# EAGLE schematic Jonah-ar PANEL - LCD-midi (EAGLE 6.4)

## Sheet 1 of 4
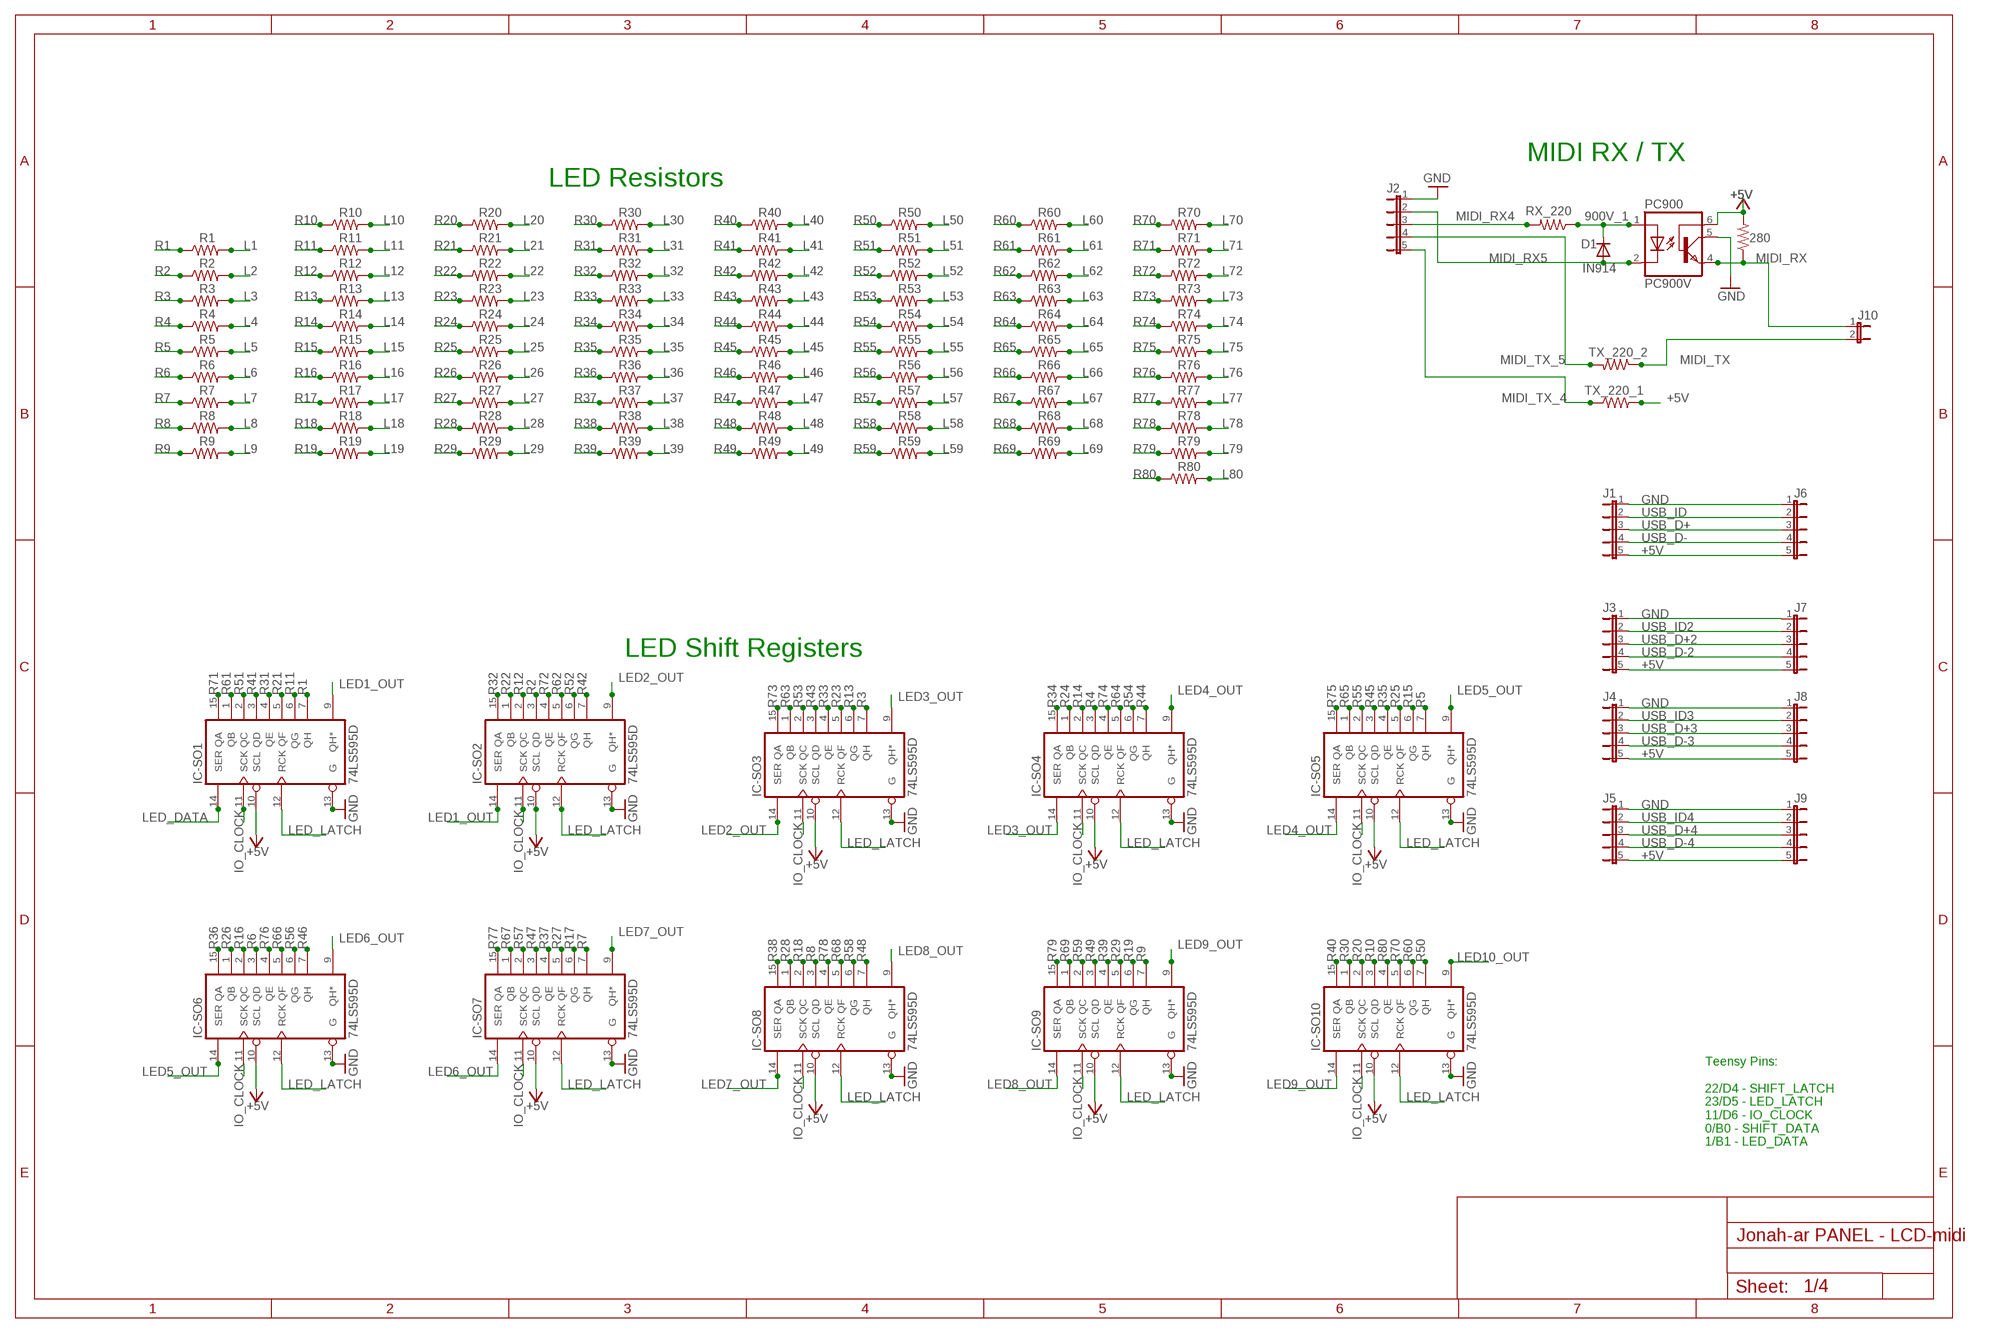
[diagram p0: schematic, sheet 1]

### Parts
280  280  R-US_0204/5  [0204/5]
D1  IN914  DIODE-DO34-7  [DO34-7]
IC-SO1  74LS595D  [SO16]
IC-SO2  74LS595D  [SO16]
IC-SO3  74LS595D  [SO16]
IC-SO4  74LS595D  [SO16]
IC-SO5  74LS595D  [SO16]
IC-SO6  74LS595D  [SO16]
IC-SO7  74LS595D  [SO16]
IC-SO8  74LS595D  [SO16]
IC-SO9  74LS595D  [SO16]
IC-SO10  74LS595D  [SO16]
J1  JP5E  [JP5]
J2  JP5E  [JP5]
J3  JP5E  [JP5]
J4  JP5E  [JP5]
J5  JP5E  [JP5]
J6  JP5E  [JP5]
J7  JP5E  [JP5]
J8  JP5E  [JP5]
J9  JP5E  [JP5]
J10  JP1E  [JP1]
PC900  PC900V  4N35SM  [DIL6-SMD]
R1  R-US_0204/5  [0204/5]
R2  R-US_0204/5  [0204/5]
R3  R-US_0204/5  [0204/5]
R4  R-US_0204/5  [0204/5]
R5  R-US_0204/5  [0204/5]
R6  R-US_0204/5  [0204/5]
R7  R-US_0204/5  [0204/5]
R8  R-US_0204/5  [0204/5]
R9  R-US_0204/5  [0204/5]
R10  R-US_0204/5  [0204/5]
R11  R-US_0204/5  [0204/5]
R12  R-US_0204/5  [0204/5]
R13  R-US_0204/5  [0204/5]
R14  R-US_0204/5  [0204/5]
R15  R-US_0204/5  [0204/5]
R16  R-US_0204/5  [0204/5]
R17  R-US_0204/5  [0204/5]
R18  R-US_0204/5  [0204/5]
R19  R-US_0204/5  [0204/5]
R20  R-US_0204/5  [0204/5]
R21  R-US_0204/5  [0204/5]
R22  R-US_0204/5  [0204/5]
R23  R-US_0204/5  [0204/5]
R24  R-US_0204/5  [0204/5]
R25  R-US_0204/5  [0204/5]
R26  R-US_0204/5  [0204/5]
R27  R-US_0204/5  [0204/5]
R28  R-US_0204/5  [0204/5]
R29  R-US_0204/5  [0204/5]
R30  R-US_0204/5  [0204/5]
R31  R-US_0204/5  [0204/5]
R32  R-US_0204/5  [0204/5]
R33  R-US_0204/5  [0204/5]
R34  R-US_0204/5  [0204/5]
R35  R-US_0204/5  [0204/5]
R36  R-US_0204/5  [0204/5]
R37  R-US_0204/5  [0204/5]
R38  R-US_0204/5  [0204/5]
R39  R-US_0204/5  [0204/5]
R40  R-US_0204/5  [0204/5]
R41  R-US_0204/5  [0204/5]
R42  R-US_0204/5  [0204/5]
R43  R-US_0204/5  [0204/5]
R44  R-US_0204/5  [0204/5]
R45  R-US_0204/5  [0204/5]
R46  R-US_0204/5  [0204/5]
R47  R-US_0204/5  [0204/5]
R48  R-US_0204/5  [0204/5]
R49  R-US_0204/5  [0204/5]
R50  R-US_0204/5  [0204/5]
R51  R-US_0204/5  [0204/5]
R52  R-US_0204/5  [0204/5]
R53  R-US_0204/5  [0204/5]
R54  R-US_0204/5  [0204/5]
R55  R-US_0204/5  [0204/5]
R56  R-US_0204/5  [0204/5]
R57  R-US_0204/5  [0204/5]
R58  R-US_0204/5  [0204/5]
R59  R-US_0204/5  [0204/5]
R60  R-US_0204/5  [0204/5]
R61  R-US_0204/5  [0204/5]
R62  R-US_0204/5  [0204/5]
R63  R-US_0204/5  [0204/5]
R64  R-US_0204/5  [0204/5]
R65  R-US_0204/5  [0204/5]
R66  R-US_0204/5  [0204/5]
R67  R-US_0204/5  [0204/5]
R68  R-US_0204/5  [0204/5]
R69  R-US_0204/5  [0204/5]
R70  R-US_0204/5  [0204/5]
R71  R-US_0204/5  [0204/5]
R72  R-US_0204/5  [0204/5]
R73  R-US_0204/5  [0204/5]
R74  R-US_0204/5  [0204/5]
R75  R-US_0204/5  [0204/5]
R76  R-US_0204/5  [0204/5]
R77  R-US_0204/5  [0204/5]
R78  R-US_0204/5  [0204/5]
R79  R-US_0204/5  [0204/5]
R80  R-US_0204/5  [0204/5]
RX_220  220  R-US_0204/5  [0204/5]
TX_220_1  220  R-US_0204/5  [0204/5]
TX_220_2  220  R-US_0204/5  [0204/5]

### Nets
900V_1: D1.C PC900.1(A) RX_220.1
+5V: 280.2 IC-SO1.10(SCL) IC-SO2.10(SCL) IC-SO3.10(SCL) IC-SO4.10(SCL) IC-SO5.10(SCL) IC-SO6.10(SCL) IC-SO7.10(SCL) IC-SO8.10(SCL) IC-SO9.10(SCL) IC-SO10.10(SCL) J1.5 J3.5 J4.5 J5.5 J6.5 J7.5 J8.5 J9.5 PC900.6(BAS) TX_220_1.2 ; also sheet 2
GND: IC-SO1.13(G) IC-SO2.13(G) IC-SO3.13(G) IC-SO4.13(G) IC-SO5.13(G) IC-SO6.13(G) IC-SO7.13(G) IC-SO8.13(G) IC-SO9.13(G) IC-SO10.13(G) J1.1 J2.1 J3.1 J4.1 J5.1 J6.1 J7.1 J8.1 J9.1 PC900.5(COL) ; also sheet 2,3,4
IO_CLOCK: IC-SO1.11(SCK) IC-SO2.11(SCK) IC-SO3.11(SCK) IC-SO4.11(SCK) IC-SO5.11(SCK) IC-SO6.11(SCK) IC-SO7.11(SCK) IC-SO8.11(SCK) IC-SO9.11(SCK) IC-SO10.11(SCK) ; also sheet 2
L1: R1.2 ; also sheet 3
L2: R2.2 ; also sheet 3
L3: R3.2 ; also sheet 3
L4: R4.2 ; also sheet 3
L5: R5.2 ; also sheet 3
L6: R6.2 ; also sheet 3
L7: R7.2 ; also sheet 3
L8: R8.2 ; also sheet 3
L9: R9.2 ; also sheet 3
L10: R10.2 ; also sheet 3
L11: R11.2 ; also sheet 3
L12: R12.2 ; also sheet 3
L13: R13.2 ; also sheet 3
L14: R14.2 ; also sheet 3
L15: R15.2 ; also sheet 3
L16: R16.2 ; also sheet 3
L17: R17.2 ; also sheet 3
L18: R18.2 ; also sheet 3
L19: R19.2 ; also sheet 3
L20: R20.2 ; also sheet 3
L21: R21.2 ; also sheet 3
L22: R22.2 ; also sheet 3
L23: R23.2 ; also sheet 3
L24: R24.2 ; also sheet 3
L25: R25.2 ; also sheet 3
L26: R26.2 ; also sheet 3
L27: R27.2 ; also sheet 3
L28: R28.2 ; also sheet 3
L29: R29.2 ; also sheet 3
L30: R30.2 ; also sheet 3
L31: R31.2 ; also sheet 3
L32: R32.2 ; also sheet 3
L33: R33.2 ; also sheet 3
L34: R34.2 ; also sheet 3
L35: R35.2 ; also sheet 3
L36: R36.2 ; also sheet 3
L37: R37.2 ; also sheet 3
L38: R38.2 ; also sheet 3
L39: R39.2 ; also sheet 3
L40: R40.2 ; also sheet 3
L41: R41.2 ; also sheet 4
L42: R42.2 ; also sheet 4
L43: R43.2 ; also sheet 4
L44: R44.2 ; also sheet 4
L45: R45.2 ; also sheet 4
L46: R46.2 ; also sheet 4
L47: R47.2 ; also sheet 4
L48: R48.2 ; also sheet 4
L49: R49.2 ; also sheet 4
L50: R50.2 ; also sheet 4
L51: R51.2 ; also sheet 4
L52: R52.2 ; also sheet 4
L53: R53.2 ; also sheet 4
L54: R54.2 ; also sheet 4
L55: R55.2 ; also sheet 4
L56: R56.2 ; also sheet 4
L57: R57.2 ; also sheet 4
L58: R58.2 ; also sheet 4
L59: R59.2 ; also sheet 4
L60: R60.2 ; also sheet 4
L61: R61.2 ; also sheet 4
L62: R62.2 ; also sheet 4
L63: R63.2 ; also sheet 4
L64: R64.2 ; also sheet 4
L65: R65.2 ; also sheet 4
L66: R66.2 ; also sheet 4
L67: R67.2 ; also sheet 4
L68: R68.2 ; also sheet 4
L69: R69.2 ; also sheet 4
L70: R70.2 ; also sheet 4
L71: R71.2 ; also sheet 4
L72: R72.2 ; also sheet 4
L73: R73.2 ; also sheet 4
L74: R74.2 ; also sheet 4
L75: R75.2 ; also sheet 4
L76: R76.2 ; also sheet 4
L77: R77.2 ; also sheet 4
L78: R78.2 ; also sheet 4
L79: R79.2 ; also sheet 4
L80: R80.2 ; also sheet 4
LED1_OUT: IC-SO1.9(QH*) IC-SO2.14(SER)
LED2_OUT: IC-SO2.9(QH*) IC-SO3.14(SER)
LED3_OUT: IC-SO3.9(QH*) IC-SO4.14(SER)
LED4_OUT: IC-SO4.9(QH*) IC-SO5.14(SER)
LED5_OUT: IC-SO5.9(QH*) IC-SO6.14(SER)
LED6_OUT: IC-SO6.9(QH*) IC-SO7.14(SER)
LED7_OUT: IC-SO7.9(QH*) IC-SO8.14(SER)
LED8_OUT: IC-SO8.9(QH*) IC-SO9.14(SER)
LED9_OUT: IC-SO9.9(QH*) IC-SO10.14(SER)
LED10_OUT: IC-SO10.9(QH*)
LED_DATA: IC-SO1.14(SER)
LED_LATCH: IC-SO1.12(RCK) IC-SO2.12(RCK) IC-SO3.12(RCK) IC-SO4.12(RCK) IC-SO5.12(RCK) IC-SO6.12(RCK) IC-SO7.12(RCK) IC-SO8.12(RCK) IC-SO9.12(RCK) IC-SO10.12(RCK)
MIDI_RX: 280.1 J10.1 PC900.4(EMI)
MIDI_RX4: J2.3 RX_220.2
MIDI_RX5: D1.A J2.2 PC900.2(C)
MIDI_TX: J10.2 TX_220_2.1
MIDI_TX_4: J2.5 TX_220_1.1
MIDI_TX_5: J2.4 TX_220_2.2
R1: IC-SO1.7(QH) R1.1
R2: IC-SO2.3(QD) R2.1
R3: IC-SO3.7(QH) R3.1
R4: IC-SO4.3(QD) R4.1
R5: IC-SO5.7(QH) R5.1
R6: IC-SO6.3(QD) R6.1
R7: IC-SO7.7(QH) R7.1
R8: IC-SO8.3(QD) R8.1
R9: IC-SO9.7(QH) R9.1
R10: IC-SO10.3(QD) R10.1
R11: IC-SO1.6(QG) R11.1
R12: IC-SO2.2(QC) R12.1
R13: IC-SO3.6(QG) R13.1
R14: IC-SO4.2(QC) R14.1
R15: IC-SO5.6(QG) R15.1
R16: IC-SO6.2(QC) R16.1
R17: IC-SO7.6(QG) R17.1
R18: IC-SO8.2(QC) R18.1
R19: IC-SO9.6(QG) R19.1
R20: IC-SO10.2(QC) R20.1
R21: IC-SO1.5(QF) R21.1
R22: IC-SO2.1(QB) R22.1
R23: IC-SO3.5(QF) R23.1
R24: IC-SO4.1(QB) R24.1
R25: IC-SO5.5(QF) R25.1
R26: IC-SO6.1(QB) R26.1
R27: IC-SO7.5(QF) R27.1
R28: IC-SO8.1(QB) R28.1
R29: IC-SO9.5(QF) R29.1
R30: IC-SO10.1(QB) R30.1
R31: IC-SO1.4(QE) R31.1
R32: IC-SO2.15(QA) R32.1
R33: IC-SO3.4(QE) R33.1
R34: IC-SO4.15(QA) R34.1
R35: IC-SO5.4(QE) R35.1
R36: IC-SO6.15(QA) R36.1
R37: IC-SO7.4(QE) R37.1
R38: IC-SO8.15(QA) R38.1
R39: IC-SO9.4(QE) R39.1
R40: IC-SO10.15(QA) R40.1
R41: IC-SO1.3(QD) R41.1
R42: IC-SO2.7(QH) R42.1
R43: IC-SO3.3(QD) R43.1
R44: IC-SO4.7(QH) R44.1
R45: IC-SO5.3(QD) R45.1
R46: IC-SO6.7(QH) R46.1
R47: IC-SO7.3(QD) R47.1
R48: IC-SO8.7(QH) R48.1
R49: IC-SO9.3(QD) R49.1
R50: IC-SO10.7(QH) R50.1
R51: IC-SO1.2(QC) R51.1
R52: IC-SO2.6(QG) R52.1
R53: IC-SO3.2(QC) R53.1
R54: IC-SO4.6(QG) R54.1
R55: IC-SO5.2(QC) R55.1
R56: IC-SO6.6(QG) R56.1
R57: IC-SO7.2(QC) R57.1
R58: IC-SO8.6(QG) R58.1
R59: IC-SO9.2(QC) R59.1
R60: IC-SO10.6(QG) R60.1
R61: IC-SO1.1(QB) R61.1
R62: IC-SO2.5(QF) R62.1
R63: IC-SO3.1(QB) R63.1
R64: IC-SO4.5(QF) R64.1
R65: IC-SO5.1(QB) R65.1
R66: IC-SO6.5(QF) R66.1
R67: IC-SO7.1(QB) R67.1
R68: IC-SO8.5(QF) R68.1
R69: IC-SO9.1(QB) R69.1
R70: IC-SO10.5(QF) R70.1
R71: IC-SO1.15(QA) R71.1
R72: IC-SO2.4(QE) R72.1
R73: IC-SO3.15(QA) R73.1
R74: IC-SO4.4(QE) R74.1
R75: IC-SO5.15(QA) R75.1
R76: IC-SO6.4(QE) R76.1
R77: IC-SO7.15(QA) R77.1
R78: IC-SO8.4(QE) R78.1
R79: IC-SO9.15(QA) R79.1
R80: IC-SO10.4(QE) R80.1
USB_D+: J1.3 J6.3
USB_D+2: J3.3 J7.3
USB_D+3: J4.3 J8.3
USB_D+4: J5.3 J9.3
USB_D-: J1.4 J6.4
USB_D-2: J3.4 J7.4
USB_D-3: J4.4 J8.4
USB_D-4: J5.4 J9.4
USB_ID: J1.2 J6.2
USB_ID2: J3.2 J7.2
USB_ID3: J4.2 J8.2
USB_ID4: J5.2 J9.2

### Notes on the sheet
- MIDI RX / TX
- LED Resistors
- LED Shift Registers
- Teensy Pins:
  
  22/D4 - SHIFT_LATCH
  23/D5 - LED_LATCH
  11/D6 - IO_CLOCK
  0/B0 - SHIFT_DATA
  1/B1 - LED_DATA

## Sheet 2 of 4
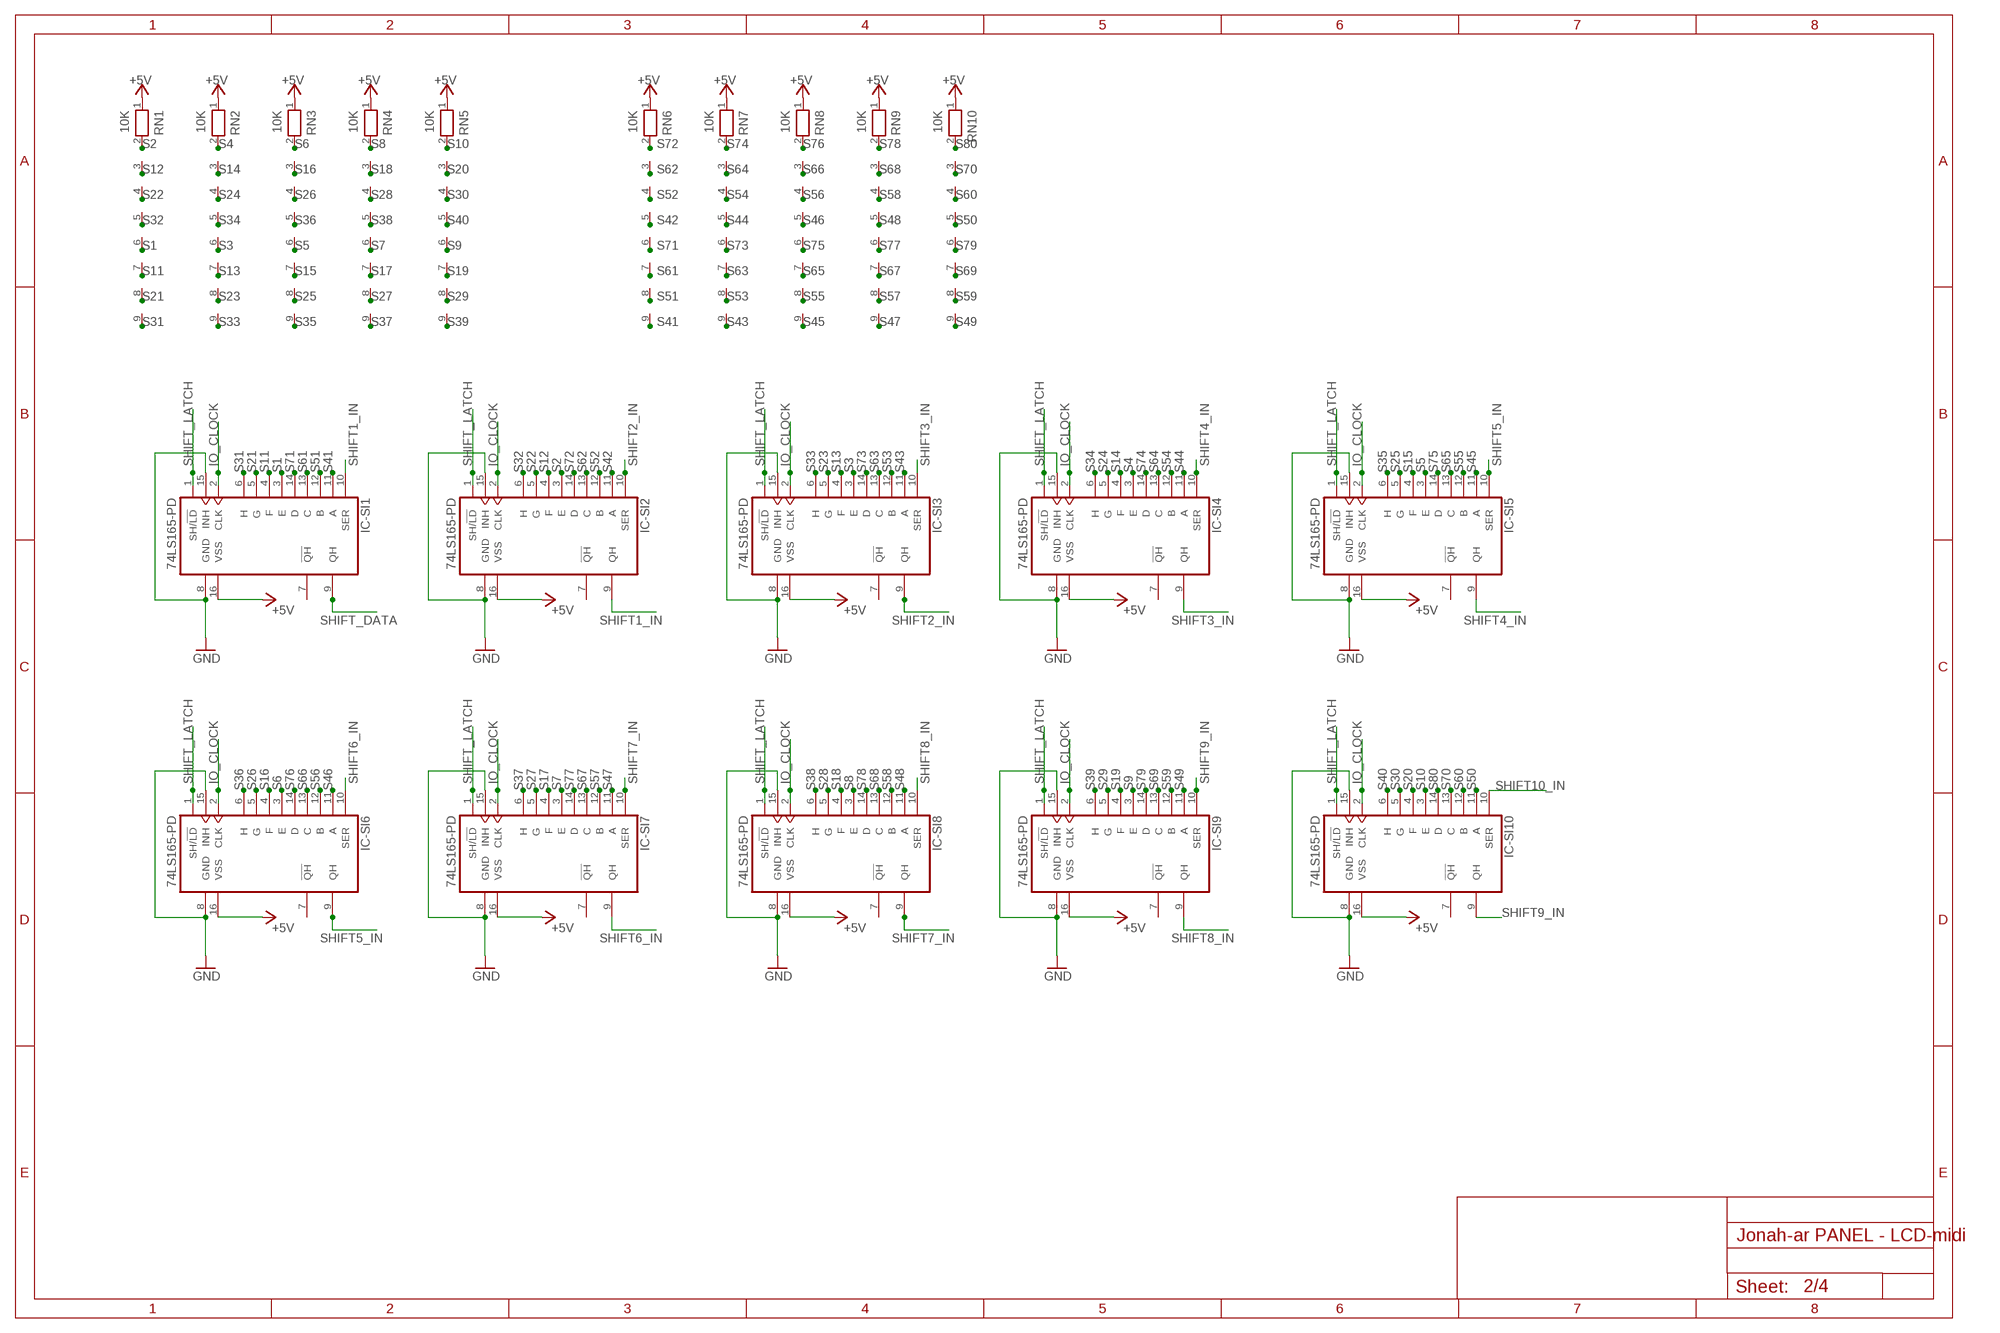
[diagram p1: schematic, sheet 2]

### Parts
IC-SI1  74LS165-PD  [SO16]
IC-SI2  74LS165-PD  [SO16]
IC-SI3  74LS165-PD  [SO16]
IC-SI4  74LS165-PD  [SO16]
IC-SI5  74LS165-PD  [SO16]
IC-SI6  74LS165-PD  [SO16]
IC-SI7  74LS165-PD  [SO16]
IC-SI8  74LS165-PD  [SO16]
IC-SI9  74LS165-PD  [SO16]
IC-SI10  74LS165-PD  [SO16]
RN1  10K  RN08  [RN-9]
RN2  10K  RN08  [RN-9]
RN3  10K  RN08  [RN-9]
RN4  10K  RN08  [RN-9]
RN5  10K  RN08  [RN-9]
RN6  10K  RN08  [RN-9]
RN7  10K  RN08  [RN-9]
RN8  10K  RN08  [RN-9]
RN9  10K  RN08  [RN-9]
RN10  10K  RN08  [RN-9]

### Nets
+5V: IC-SI1.16(VSS) IC-SI2.16(VSS) IC-SI3.16(VSS) IC-SI4.16(VSS) IC-SI5.16(VSS) IC-SI6.16(VSS) IC-SI7.16(VSS) IC-SI8.16(VSS) IC-SI9.16(VSS) IC-SI10.16(VSS) RN1.1 RN2.1 RN3.1 RN4.1 RN5.1 RN6.1 RN7.1 RN8.1 RN9.1 RN10.1 ; also sheet 1
GND: IC-SI1.8(GND) IC-SI1.15(INH) IC-SI2.8(GND) IC-SI2.15(INH) IC-SI3.8(GND) IC-SI3.15(INH) IC-SI4.8(GND) IC-SI4.15(INH) IC-SI5.8(GND) IC-SI5.15(INH) IC-SI6.8(GND) IC-SI6.15(INH) IC-SI7.8(GND) IC-SI7.15(INH) IC-SI8.8(GND) IC-SI8.15(INH) IC-SI9.8(GND) IC-SI9.15(INH) IC-SI10.8(GND) IC-SI10.15(INH) ; also sheet 1,3,4
IO_CLOCK: IC-SI1.2(CLK) IC-SI2.2(CLK) IC-SI3.2(CLK) IC-SI4.2(CLK) IC-SI5.2(CLK) IC-SI6.2(CLK) IC-SI7.2(CLK) IC-SI8.2(CLK) IC-SI9.2(CLK) IC-SI10.2(CLK) ; also sheet 1
S1: IC-SI1.3(E) RN1.6 ; also sheet 3
S2: IC-SI2.3(E) RN1.2 ; also sheet 3
S3: IC-SI3.3(E) RN2.6 ; also sheet 3
S4: IC-SI4.3(E) RN2.2 ; also sheet 3
S5: IC-SI5.3(E) RN3.6 ; also sheet 3
S6: IC-SI6.3(E) RN3.2 ; also sheet 3
S7: IC-SI7.3(E) RN4.6 ; also sheet 3
S8: IC-SI8.3(E) RN4.2 ; also sheet 3
S9: IC-SI9.3(E) RN5.6 ; also sheet 3
S10: IC-SI10.3(E) RN5.2 ; also sheet 3
S11: IC-SI1.4(F) RN1.7 ; also sheet 3
S12: IC-SI2.4(F) RN1.3 ; also sheet 3
S13: IC-SI3.4(F) RN2.7 ; also sheet 3
S14: IC-SI4.4(F) RN2.3 ; also sheet 3
S15: IC-SI5.4(F) RN3.7 ; also sheet 3
S16: IC-SI6.4(F) RN3.3 ; also sheet 3
S17: IC-SI7.4(F) RN4.7 ; also sheet 3
S18: IC-SI8.4(F) RN4.3 ; also sheet 3
S19: IC-SI9.4(F) RN5.7 ; also sheet 3
S20: IC-SI10.4(F) RN5.3 ; also sheet 3
S21: IC-SI1.5(G) RN1.8 ; also sheet 3
S22: IC-SI2.5(G) RN1.4 ; also sheet 3
S23: IC-SI3.5(G) RN2.8 ; also sheet 3
S24: IC-SI4.5(G) RN2.4 ; also sheet 3
S25: IC-SI5.5(G) RN3.8 ; also sheet 3
S26: IC-SI6.5(G) RN3.4 ; also sheet 3
S27: IC-SI7.5(G) RN4.8 ; also sheet 3
S28: IC-SI8.5(G) RN4.4 ; also sheet 3
S29: IC-SI9.5(G) RN5.8 ; also sheet 3
S30: IC-SI10.5(G) RN5.4 ; also sheet 3
S31: IC-SI1.6(H) RN1.9 ; also sheet 3
S32: IC-SI2.6(H) RN1.5 ; also sheet 3
S33: IC-SI3.6(H) RN2.9 ; also sheet 3
S34: IC-SI4.6(H) RN2.5 ; also sheet 3
S35: IC-SI5.6(H) RN3.9 ; also sheet 3
S36: IC-SI6.6(H) RN3.5 ; also sheet 3
S37: IC-SI7.6(H) RN4.9 ; also sheet 3
S38: IC-SI8.6(H) RN4.5 ; also sheet 3
S39: IC-SI9.6(H) RN5.9 ; also sheet 3
S40: IC-SI10.6(H) RN5.5 ; also sheet 3
S41: IC-SI1.11(A) RN6.9 ; also sheet 4
S42: IC-SI2.11(A) RN6.5 ; also sheet 4
S43: IC-SI3.11(A) RN7.9 ; also sheet 4
S44: IC-SI4.11(A) RN7.5 ; also sheet 4
S45: IC-SI5.11(A) RN8.9 ; also sheet 4
S46: IC-SI6.11(A) RN8.5 ; also sheet 4
S47: IC-SI7.11(A) RN9.9 ; also sheet 4
S48: IC-SI8.11(A) RN9.5 ; also sheet 4
S49: IC-SI9.11(A) RN10.9 ; also sheet 4
S50: IC-SI10.11(A) RN10.5 ; also sheet 4
S51: IC-SI1.12(B) RN6.8 ; also sheet 4
S52: IC-SI2.12(B) RN6.4 ; also sheet 4
S53: IC-SI3.12(B) RN7.8 ; also sheet 4
S54: IC-SI4.12(B) RN7.4 ; also sheet 4
S55: IC-SI5.12(B) RN8.8 ; also sheet 4
S56: IC-SI6.12(B) RN8.4 ; also sheet 4
S57: IC-SI7.12(B) RN9.8 ; also sheet 4
S58: IC-SI8.12(B) RN9.4 ; also sheet 4
S59: IC-SI9.12(B) RN10.8 ; also sheet 4
S60: IC-SI10.12(B) RN10.4 ; also sheet 4
S61: IC-SI1.13(C) RN6.7 ; also sheet 4
S62: IC-SI2.13(C) RN6.3 ; also sheet 4
S63: IC-SI3.13(C) RN7.7 ; also sheet 4
S64: IC-SI4.13(C) RN7.3 ; also sheet 4
S65: IC-SI5.13(C) RN8.7 ; also sheet 4
S66: IC-SI6.13(C) RN8.3 ; also sheet 4
S67: IC-SI7.13(C) RN9.7 ; also sheet 4
S68: IC-SI8.13(C) RN9.3 ; also sheet 4
S69: IC-SI9.13(C) RN10.7 ; also sheet 4
S70: IC-SI10.13(C) RN10.3 ; also sheet 4
S71: IC-SI1.14(D) RN6.6 ; also sheet 4
S72: IC-SI2.14(D) RN6.2 ; also sheet 4
S73: IC-SI3.14(D) RN7.6 ; also sheet 4
S74: IC-SI4.14(D) RN7.2 ; also sheet 4
S75: IC-SI5.14(D) RN8.6 ; also sheet 4
S76: IC-SI6.14(D) RN8.2 ; also sheet 4
S77: IC-SI7.14(D) RN9.6 ; also sheet 4
S78: IC-SI8.14(D) RN9.2 ; also sheet 4
S79: IC-SI9.14(D) RN10.6 ; also sheet 4
S80: IC-SI10.14(D) RN10.2 ; also sheet 4
SHIFT1_IN: IC-SI1.10(SER) IC-SI2.9(QH)
SHIFT2_IN: IC-SI2.10(SER) IC-SI3.9(QH)
SHIFT3_IN: IC-SI3.10(SER) IC-SI4.9(QH)
SHIFT4_IN: IC-SI4.10(SER) IC-SI5.9(QH)
SHIFT5_IN: IC-SI5.10(SER) IC-SI6.9(QH)
SHIFT6_IN: IC-SI6.10(SER) IC-SI7.9(QH)
SHIFT7_IN: IC-SI7.10(SER) IC-SI8.9(QH)
SHIFT8_IN: IC-SI8.10(SER) IC-SI9.9(QH)
SHIFT9_IN: IC-SI9.10(SER) IC-SI10.9(QH)
SHIFT10_IN: IC-SI10.10(SER)
SHIFT_DATA: IC-SI1.9(QH)
SHIFT_LATCH: IC-SI1.1(SH/!LD) IC-SI2.1(SH/!LD) IC-SI3.1(SH/!LD) IC-SI4.1(SH/!LD) IC-SI5.1(SH/!LD) IC-SI6.1(SH/!LD) IC-SI7.1(SH/!LD) IC-SI8.1(SH/!LD) IC-SI9.1(SH/!LD) IC-SI10.1(SH/!LD)
Unconnected: IC-SI1.7(!QH) IC-SI2.7(!QH) IC-SI3.7(!QH) IC-SI4.7(!QH) IC-SI5.7(!QH) IC-SI6.7(!QH) IC-SI7.7(!QH) IC-SI8.7(!QH) IC-SI9.7(!QH) IC-SI10.7(!QH)

## Sheet 3 of 4
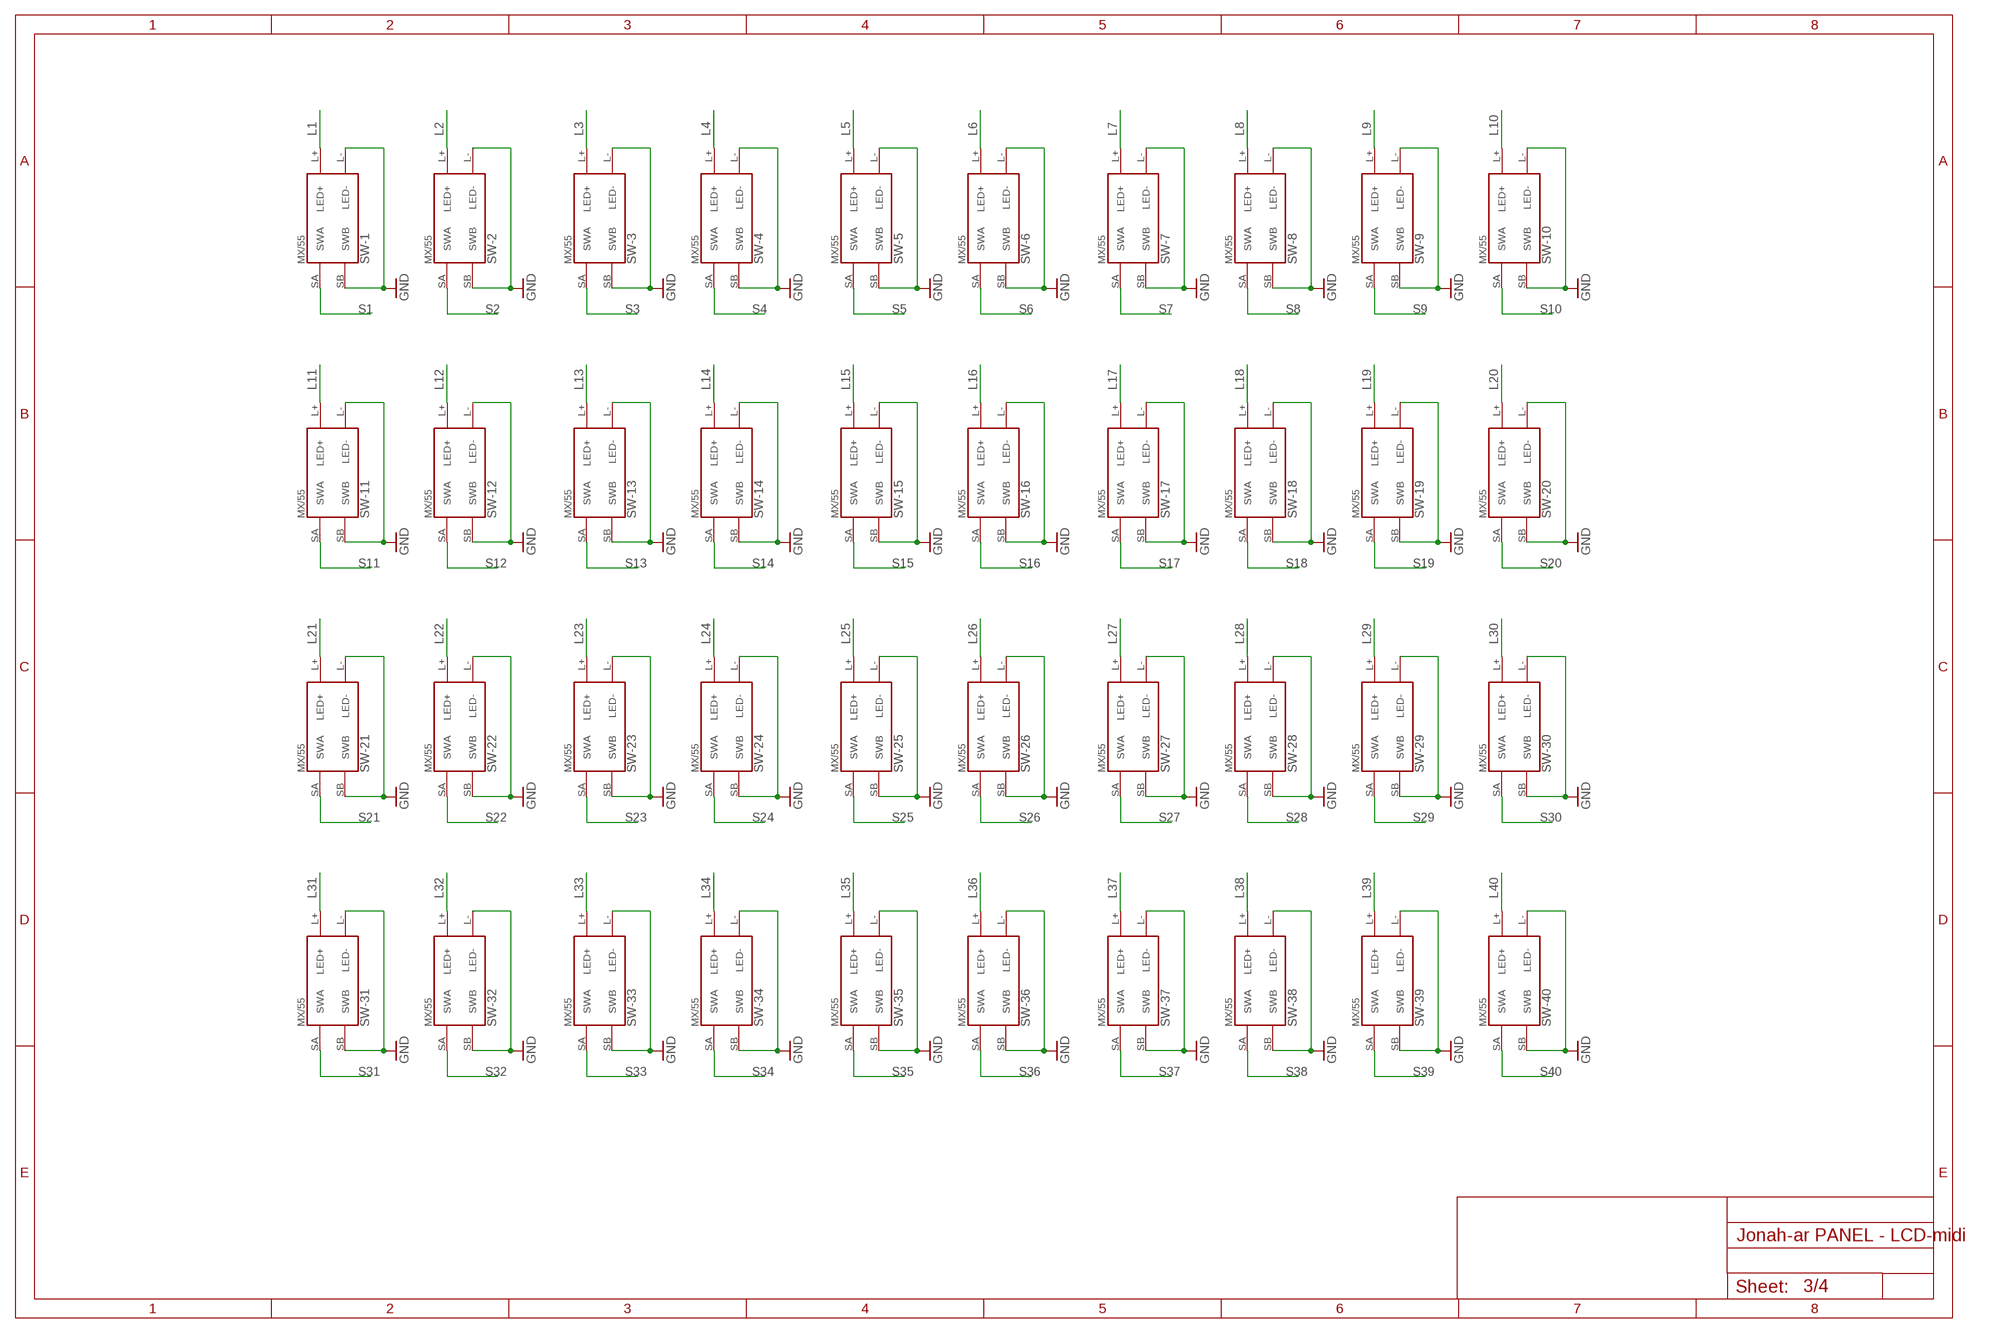
[diagram p2: schematic, sheet 3]

### Parts
SW-1  CHERRY-MX-LED  [CHERRY-MX-LED]
SW-2  CHERRY-MX-LED  [CHERRY-MX-LED]
SW-3  CHERRY-MX-LED  [CHERRY-MX-LED]
SW-4  CHERRY-MX-LED  [CHERRY-MX-LED]
SW-5  CHERRY-MX-LED  [CHERRY-MX-LED]
SW-6  CHERRY-MX-LED  [CHERRY-MX-LED]
SW-7  CHERRY-MX-LED  [CHERRY-MX-LED]
SW-8  CHERRY-MX-LED  [CHERRY-MX-LED]
SW-9  CHERRY-MX-LED  [CHERRY-MX-LED]
SW-10  CHERRY-MX-LED  [CHERRY-MX-LED]
SW-11  CHERRY-MX-LED  [CHERRY-MX-LED]
SW-12  CHERRY-MX-LED  [CHERRY-MX-LED]
SW-13  CHERRY-MX-LED  [CHERRY-MX-LED]
SW-14  CHERRY-MX-LED  [CHERRY-MX-LED]
SW-15  CHERRY-MX-LED  [CHERRY-MX-LED]
SW-16  CHERRY-MX-LED  [CHERRY-MX-LED]
SW-17  CHERRY-MX-LED  [CHERRY-MX-LED]
SW-18  CHERRY-MX-LED  [CHERRY-MX-LED]
SW-19  CHERRY-MX-LED  [CHERRY-MX-LED]
SW-20  CHERRY-MX-LED  [CHERRY-MX-LED]
SW-21  CHERRY-MX-LED  [CHERRY-MX-LED]
SW-22  CHERRY-MX-LED  [CHERRY-MX-LED]
SW-23  CHERRY-MX-LED  [CHERRY-MX-LED]
SW-24  CHERRY-MX-LED  [CHERRY-MX-LED]
SW-25  CHERRY-MX-LED  [CHERRY-MX-LED]
SW-26  CHERRY-MX-LED  [CHERRY-MX-LED]
SW-27  CHERRY-MX-LED  [CHERRY-MX-LED]
SW-28  CHERRY-MX-LED  [CHERRY-MX-LED]
SW-29  CHERRY-MX-LED  [CHERRY-MX-LED]
SW-30  CHERRY-MX-LED  [CHERRY-MX-LED]
SW-31  CHERRY-MX-LED  [CHERRY-MX-LED]
SW-32  CHERRY-MX-LED  [CHERRY-MX-LED]
SW-33  CHERRY-MX-LED  [CHERRY-MX-LED]
SW-34  CHERRY-MX-LED  [CHERRY-MX-LED]
SW-35  CHERRY-MX-LED  [CHERRY-MX-LED]
SW-36  CHERRY-MX-LED  [CHERRY-MX-LED]
SW-37  CHERRY-MX-LED  [CHERRY-MX-LED]
SW-38  CHERRY-MX-LED  [CHERRY-MX-LED]
SW-39  CHERRY-MX-LED  [CHERRY-MX-LED]
SW-40  CHERRY-MX-LED  [CHERRY-MX-LED]

### Nets
GND: SW-1.L-(LED-) SW-1.SB(SWB) SW-2.L-(LED-) SW-2.SB(SWB) SW-3.L-(LED-) SW-3.SB(SWB) SW-4.L-(LED-) SW-4.SB(SWB) SW-5.L-(LED-) SW-5.SB(SWB) SW-6.L-(LED-) SW-6.SB(SWB) SW-7.L-(LED-) SW-7.SB(SWB) SW-8.L-(LED-) SW-8.SB(SWB) SW-9.L-(LED-) SW-9.SB(SWB) SW-10.L-(LED-) SW-10.SB(SWB) SW-11.L-(LED-) SW-11.SB(SWB) SW-12.L-(LED-) SW-12.SB(SWB) SW-13.L-(LED-) SW-13.SB(SWB) SW-14.L-(LED-) SW-14.SB(SWB) SW-15.L-(LED-) SW-15.SB(SWB) SW-16.L-(LED-) SW-16.SB(SWB) SW-17.L-(LED-) SW-17.SB(SWB) SW-18.L-(LED-) SW-18.SB(SWB) SW-19.L-(LED-) SW-19.SB(SWB) SW-20.L-(LED-) SW-20.SB(SWB) SW-21.L-(LED-) SW-21.SB(SWB) SW-22.L-(LED-) SW-22.SB(SWB) SW-23.L-(LED-) SW-23.SB(SWB) SW-24.L-(LED-) SW-24.SB(SWB) SW-25.L-(LED-) SW-25.SB(SWB) SW-26.L-(LED-) SW-26.SB(SWB) SW-27.L-(LED-) SW-27.SB(SWB) SW-28.L-(LED-) SW-28.SB(SWB) SW-29.L-(LED-) SW-29.SB(SWB) SW-30.L-(LED-) SW-30.SB(SWB) SW-31.L-(LED-) SW-31.SB(SWB) SW-32.L-(LED-) SW-32.SB(SWB) SW-33.L-(LED-) SW-33.SB(SWB) SW-34.L-(LED-) SW-34.SB(SWB) SW-35.L-(LED-) SW-35.SB(SWB) SW-36.L-(LED-) SW-36.SB(SWB) SW-37.L-(LED-) SW-37.SB(SWB) SW-38.L-(LED-) SW-38.SB(SWB) SW-39.L-(LED-) SW-39.SB(SWB) SW-40.L-(LED-) SW-40.SB(SWB) ; also sheet 1,2,4
L1: SW-1.L+(LED+) ; also sheet 1
L2: SW-2.L+(LED+) ; also sheet 1
L3: SW-3.L+(LED+) ; also sheet 1
L4: SW-4.L+(LED+) ; also sheet 1
L5: SW-5.L+(LED+) ; also sheet 1
L6: SW-6.L+(LED+) ; also sheet 1
L7: SW-7.L+(LED+) ; also sheet 1
L8: SW-8.L+(LED+) ; also sheet 1
L9: SW-9.L+(LED+) ; also sheet 1
L10: SW-10.L+(LED+) ; also sheet 1
L11: SW-11.L+(LED+) ; also sheet 1
L12: SW-12.L+(LED+) ; also sheet 1
L13: SW-13.L+(LED+) ; also sheet 1
L14: SW-14.L+(LED+) ; also sheet 1
L15: SW-15.L+(LED+) ; also sheet 1
L16: SW-16.L+(LED+) ; also sheet 1
L17: SW-17.L+(LED+) ; also sheet 1
L18: SW-18.L+(LED+) ; also sheet 1
L19: SW-19.L+(LED+) ; also sheet 1
L20: SW-20.L+(LED+) ; also sheet 1
L21: SW-21.L+(LED+) ; also sheet 1
L22: SW-22.L+(LED+) ; also sheet 1
L23: SW-23.L+(LED+) ; also sheet 1
L24: SW-24.L+(LED+) ; also sheet 1
L25: SW-25.L+(LED+) ; also sheet 1
L26: SW-26.L+(LED+) ; also sheet 1
L27: SW-27.L+(LED+) ; also sheet 1
L28: SW-28.L+(LED+) ; also sheet 1
L29: SW-29.L+(LED+) ; also sheet 1
L30: SW-30.L+(LED+) ; also sheet 1
L31: SW-31.L+(LED+) ; also sheet 1
L32: SW-32.L+(LED+) ; also sheet 1
L33: SW-33.L+(LED+) ; also sheet 1
L34: SW-34.L+(LED+) ; also sheet 1
L35: SW-35.L+(LED+) ; also sheet 1
L36: SW-36.L+(LED+) ; also sheet 1
L37: SW-37.L+(LED+) ; also sheet 1
L38: SW-38.L+(LED+) ; also sheet 1
L39: SW-39.L+(LED+) ; also sheet 1
L40: SW-40.L+(LED+) ; also sheet 1
S1: SW-1.SA(SWA) ; also sheet 2
S2: SW-2.SA(SWA) ; also sheet 2
S3: SW-3.SA(SWA) ; also sheet 2
S4: SW-4.SA(SWA) ; also sheet 2
S5: SW-5.SA(SWA) ; also sheet 2
S6: SW-6.SA(SWA) ; also sheet 2
S7: SW-7.SA(SWA) ; also sheet 2
S8: SW-8.SA(SWA) ; also sheet 2
S9: SW-9.SA(SWA) ; also sheet 2
S10: SW-10.SA(SWA) ; also sheet 2
S11: SW-11.SA(SWA) ; also sheet 2
S12: SW-12.SA(SWA) ; also sheet 2
S13: SW-13.SA(SWA) ; also sheet 2
S14: SW-14.SA(SWA) ; also sheet 2
S15: SW-15.SA(SWA) ; also sheet 2
S16: SW-16.SA(SWA) ; also sheet 2
S17: SW-17.SA(SWA) ; also sheet 2
S18: SW-18.SA(SWA) ; also sheet 2
S19: SW-19.SA(SWA) ; also sheet 2
S20: SW-20.SA(SWA) ; also sheet 2
S21: SW-21.SA(SWA) ; also sheet 2
S22: SW-22.SA(SWA) ; also sheet 2
S23: SW-23.SA(SWA) ; also sheet 2
S24: SW-24.SA(SWA) ; also sheet 2
S25: SW-25.SA(SWA) ; also sheet 2
S26: SW-26.SA(SWA) ; also sheet 2
S27: SW-27.SA(SWA) ; also sheet 2
S28: SW-28.SA(SWA) ; also sheet 2
S29: SW-29.SA(SWA) ; also sheet 2
S30: SW-30.SA(SWA) ; also sheet 2
S31: SW-31.SA(SWA) ; also sheet 2
S32: SW-32.SA(SWA) ; also sheet 2
S33: SW-33.SA(SWA) ; also sheet 2
S34: SW-34.SA(SWA) ; also sheet 2
S35: SW-35.SA(SWA) ; also sheet 2
S36: SW-36.SA(SWA) ; also sheet 2
S37: SW-37.SA(SWA) ; also sheet 2
S38: SW-38.SA(SWA) ; also sheet 2
S39: SW-39.SA(SWA) ; also sheet 2
S40: SW-40.SA(SWA) ; also sheet 2

## Sheet 4 of 4
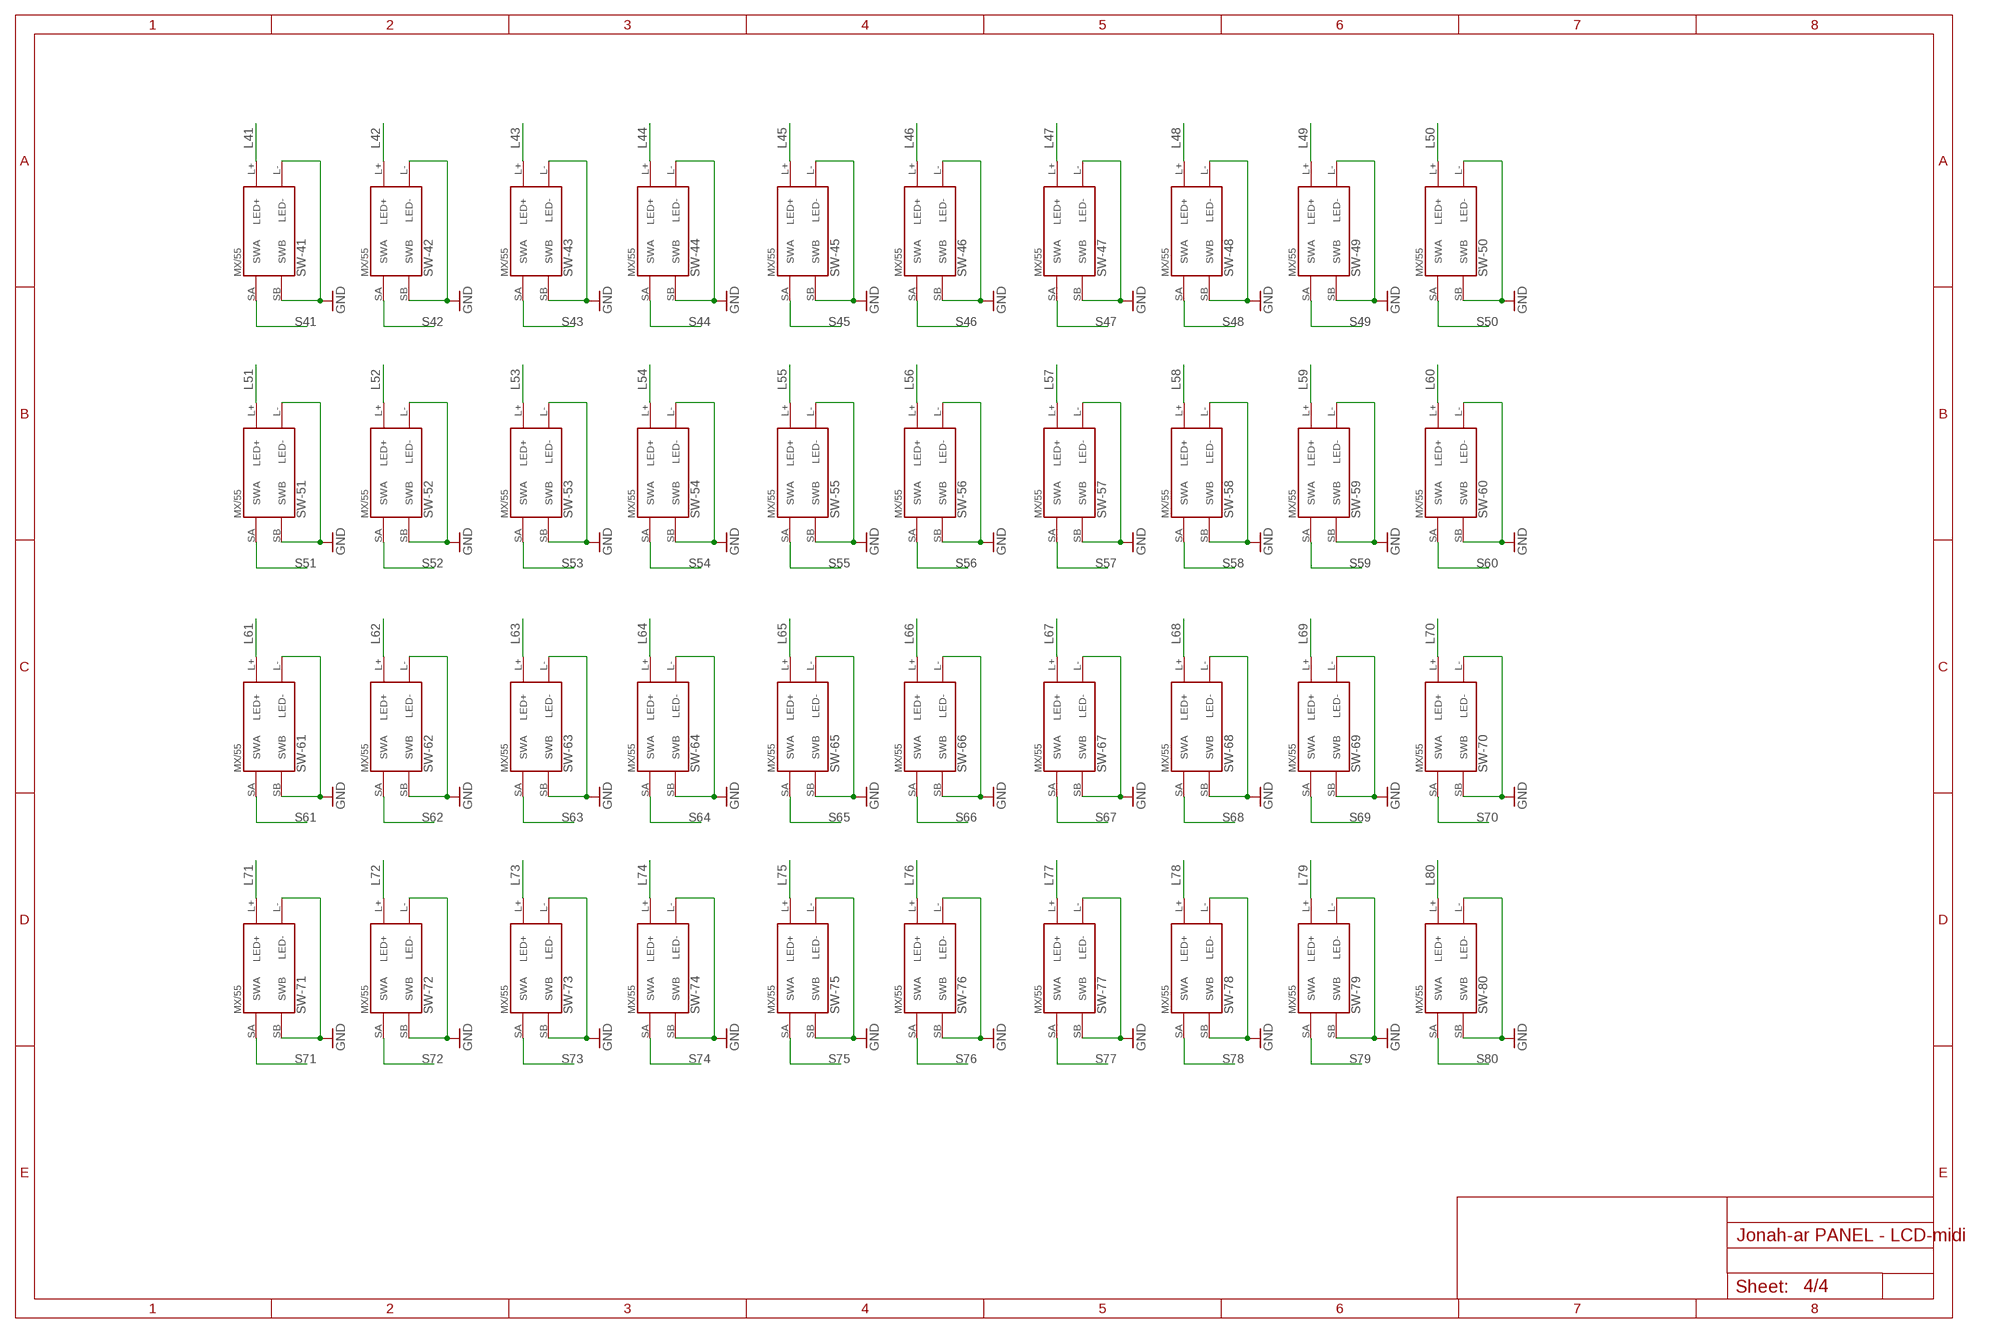
[diagram p3: schematic, sheet 4]

### Parts
SW-41  CHERRY-MX-LED  [CHERRY-MX-LED]
SW-42  CHERRY-MX-LED  [CHERRY-MX-LED]
SW-43  CHERRY-MX-LED  [CHERRY-MX-LED]
SW-44  CHERRY-MX-LED  [CHERRY-MX-LED]
SW-45  CHERRY-MX-LED  [CHERRY-MX-LED]
SW-46  CHERRY-MX-LED  [CHERRY-MX-LED]
SW-47  CHERRY-MX-LED  [CHERRY-MX-LED]
SW-48  CHERRY-MX-LED  [CHERRY-MX-LED]
SW-49  CHERRY-MX-LED  [CHERRY-MX-LED]
SW-50  CHERRY-MX-LED  [CHERRY-MX-LED]
SW-51  CHERRY-MX-LED  [CHERRY-MX-LED]
SW-52  CHERRY-MX-LED  [CHERRY-MX-LED]
SW-53  CHERRY-MX-LED  [CHERRY-MX-LED]
SW-54  CHERRY-MX-LED  [CHERRY-MX-LED]
SW-55  CHERRY-MX-LED  [CHERRY-MX-LED]
SW-56  CHERRY-MX-LED  [CHERRY-MX-LED]
SW-57  CHERRY-MX-LED  [CHERRY-MX-LED]
SW-58  CHERRY-MX-LED  [CHERRY-MX-LED]
SW-59  CHERRY-MX-LED  [CHERRY-MX-LED]
SW-60  CHERRY-MX-LED  [CHERRY-MX-LED]
SW-61  CHERRY-MX-LED  [CHERRY-MX-LED]
SW-62  CHERRY-MX-LED  [CHERRY-MX-LED]
SW-63  CHERRY-MX-LED  [CHERRY-MX-LED]
SW-64  CHERRY-MX-LED  [CHERRY-MX-LED]
SW-65  CHERRY-MX-LED  [CHERRY-MX-LED]
SW-66  CHERRY-MX-LED  [CHERRY-MX-LED]
SW-67  CHERRY-MX-LED  [CHERRY-MX-LED]
SW-68  CHERRY-MX-LED  [CHERRY-MX-LED]
SW-69  CHERRY-MX-LED  [CHERRY-MX-LED]
SW-70  CHERRY-MX-LED  [CHERRY-MX-LED]
SW-71  CHERRY-MX-LED  [CHERRY-MX-LED]
SW-72  CHERRY-MX-LED  [CHERRY-MX-LED]
SW-73  CHERRY-MX-LED  [CHERRY-MX-LED]
SW-74  CHERRY-MX-LED  [CHERRY-MX-LED]
SW-75  CHERRY-MX-LED  [CHERRY-MX-LED]
SW-76  CHERRY-MX-LED  [CHERRY-MX-LED]
SW-77  CHERRY-MX-LED  [CHERRY-MX-LED]
SW-78  CHERRY-MX-LED  [CHERRY-MX-LED]
SW-79  CHERRY-MX-LED  [CHERRY-MX-LED]
SW-80  CHERRY-MX-LED  [CHERRY-MX-LED]

### Nets
GND: SW-41.L-(LED-) SW-41.SB(SWB) SW-42.L-(LED-) SW-42.SB(SWB) SW-43.L-(LED-) SW-43.SB(SWB) SW-44.L-(LED-) SW-44.SB(SWB) SW-45.L-(LED-) SW-45.SB(SWB) SW-46.L-(LED-) SW-46.SB(SWB) SW-47.L-(LED-) SW-47.SB(SWB) SW-48.L-(LED-) SW-48.SB(SWB) SW-49.L-(LED-) SW-49.SB(SWB) SW-50.L-(LED-) SW-50.SB(SWB) SW-51.L-(LED-) SW-51.SB(SWB) SW-52.L-(LED-) SW-52.SB(SWB) SW-53.L-(LED-) SW-53.SB(SWB) SW-54.L-(LED-) SW-54.SB(SWB) SW-55.L-(LED-) SW-55.SB(SWB) SW-56.L-(LED-) SW-56.SB(SWB) SW-57.L-(LED-) SW-57.SB(SWB) SW-58.L-(LED-) SW-58.SB(SWB) SW-59.L-(LED-) SW-59.SB(SWB) SW-60.L-(LED-) SW-60.SB(SWB) SW-61.L-(LED-) SW-61.SB(SWB) SW-62.L-(LED-) SW-62.SB(SWB) SW-63.L-(LED-) SW-63.SB(SWB) SW-64.L-(LED-) SW-64.SB(SWB) SW-65.L-(LED-) SW-65.SB(SWB) SW-66.L-(LED-) SW-66.SB(SWB) SW-67.L-(LED-) SW-67.SB(SWB) SW-68.L-(LED-) SW-68.SB(SWB) SW-69.L-(LED-) SW-69.SB(SWB) SW-70.L-(LED-) SW-70.SB(SWB) SW-71.L-(LED-) SW-71.SB(SWB) SW-72.L-(LED-) SW-72.SB(SWB) SW-73.L-(LED-) SW-73.SB(SWB) SW-74.L-(LED-) SW-74.SB(SWB) SW-75.L-(LED-) SW-75.SB(SWB) SW-76.L-(LED-) SW-76.SB(SWB) SW-77.L-(LED-) SW-77.SB(SWB) SW-78.L-(LED-) SW-78.SB(SWB) SW-79.L-(LED-) SW-79.SB(SWB) SW-80.L-(LED-) SW-80.SB(SWB) ; also sheet 1,2,3
L41: SW-41.L+(LED+) ; also sheet 1
L42: SW-42.L+(LED+) ; also sheet 1
L43: SW-43.L+(LED+) ; also sheet 1
L44: SW-44.L+(LED+) ; also sheet 1
L45: SW-45.L+(LED+) ; also sheet 1
L46: SW-46.L+(LED+) ; also sheet 1
L47: SW-47.L+(LED+) ; also sheet 1
L48: SW-48.L+(LED+) ; also sheet 1
L49: SW-49.L+(LED+) ; also sheet 1
L50: SW-50.L+(LED+) ; also sheet 1
L51: SW-51.L+(LED+) ; also sheet 1
L52: SW-52.L+(LED+) ; also sheet 1
L53: SW-53.L+(LED+) ; also sheet 1
L54: SW-54.L+(LED+) ; also sheet 1
L55: SW-55.L+(LED+) ; also sheet 1
L56: SW-56.L+(LED+) ; also sheet 1
L57: SW-57.L+(LED+) ; also sheet 1
L58: SW-58.L+(LED+) ; also sheet 1
L59: SW-59.L+(LED+) ; also sheet 1
L60: SW-60.L+(LED+) ; also sheet 1
L61: SW-61.L+(LED+) ; also sheet 1
L62: SW-62.L+(LED+) ; also sheet 1
L63: SW-63.L+(LED+) ; also sheet 1
L64: SW-64.L+(LED+) ; also sheet 1
L65: SW-65.L+(LED+) ; also sheet 1
L66: SW-66.L+(LED+) ; also sheet 1
L67: SW-67.L+(LED+) ; also sheet 1
L68: SW-68.L+(LED+) ; also sheet 1
L69: SW-69.L+(LED+) ; also sheet 1
L70: SW-70.L+(LED+) ; also sheet 1
L71: SW-71.L+(LED+) ; also sheet 1
L72: SW-72.L+(LED+) ; also sheet 1
L73: SW-73.L+(LED+) ; also sheet 1
L74: SW-74.L+(LED+) ; also sheet 1
L75: SW-75.L+(LED+) ; also sheet 1
L76: SW-76.L+(LED+) ; also sheet 1
L77: SW-77.L+(LED+) ; also sheet 1
L78: SW-78.L+(LED+) ; also sheet 1
L79: SW-79.L+(LED+) ; also sheet 1
L80: SW-80.L+(LED+) ; also sheet 1
S41: SW-41.SA(SWA) ; also sheet 2
S42: SW-42.SA(SWA) ; also sheet 2
S43: SW-43.SA(SWA) ; also sheet 2
S44: SW-44.SA(SWA) ; also sheet 2
S45: SW-45.SA(SWA) ; also sheet 2
S46: SW-46.SA(SWA) ; also sheet 2
S47: SW-47.SA(SWA) ; also sheet 2
S48: SW-48.SA(SWA) ; also sheet 2
S49: SW-49.SA(SWA) ; also sheet 2
S50: SW-50.SA(SWA) ; also sheet 2
S51: SW-51.SA(SWA) ; also sheet 2
S52: SW-52.SA(SWA) ; also sheet 2
S53: SW-53.SA(SWA) ; also sheet 2
S54: SW-54.SA(SWA) ; also sheet 2
S55: SW-55.SA(SWA) ; also sheet 2
S56: SW-56.SA(SWA) ; also sheet 2
S57: SW-57.SA(SWA) ; also sheet 2
S58: SW-58.SA(SWA) ; also sheet 2
S59: SW-59.SA(SWA) ; also sheet 2
S60: SW-60.SA(SWA) ; also sheet 2
S61: SW-61.SA(SWA) ; also sheet 2
S62: SW-62.SA(SWA) ; also sheet 2
S63: SW-63.SA(SWA) ; also sheet 2
S64: SW-64.SA(SWA) ; also sheet 2
S65: SW-65.SA(SWA) ; also sheet 2
S66: SW-66.SA(SWA) ; also sheet 2
S67: SW-67.SA(SWA) ; also sheet 2
S68: SW-68.SA(SWA) ; also sheet 2
S69: SW-69.SA(SWA) ; also sheet 2
S70: SW-70.SA(SWA) ; also sheet 2
S71: SW-71.SA(SWA) ; also sheet 2
S72: SW-72.SA(SWA) ; also sheet 2
S73: SW-73.SA(SWA) ; also sheet 2
S74: SW-74.SA(SWA) ; also sheet 2
S75: SW-75.SA(SWA) ; also sheet 2
S76: SW-76.SA(SWA) ; also sheet 2
S77: SW-77.SA(SWA) ; also sheet 2
S78: SW-78.SA(SWA) ; also sheet 2
S79: SW-79.SA(SWA) ; also sheet 2
S80: SW-80.SA(SWA) ; also sheet 2

## Power pins joined to a net without a drawn wire
+5V: IC-SO1.16(+5V) IC-SO2.16(+5V) IC-SO3.16(+5V) IC-SO4.16(+5V) IC-SO5.16(+5V) IC-SO6.16(+5V) IC-SO7.16(+5V) IC-SO8.16(+5V) IC-SO9.16(+5V) IC-SO10.16(+5V)
GND: IC-SO1.8(GND) IC-SO2.8(GND) IC-SO3.8(GND) IC-SO4.8(GND) IC-SO5.8(GND) IC-SO6.8(GND) IC-SO7.8(GND) IC-SO8.8(GND) IC-SO9.8(GND) IC-SO10.8(GND)

## Library data of the parts
280 R1-R80 RX_220 TX_220_1 TX_220_2 = resistor:R-US_: RESISTOR, American symbol
D1 = diode:DIODE-: DIODE
IC-SI1-IC-SI10 = 74xx-us:74*165-P: 8-bit parallel load SHIFT REGISTER
IC-SO1-IC-SO10 = 74xx-us:74*595: 8-bit SHIFT REGISTER, output latch
J1-J9 = jumper:JP5E
J10 = jumper:JP1E: JUMPER
PC900 = optocoupler:4N*?M: General Purpose 6-Pin Phototransistor Optocouplers Source: http://www.fairchildsemi.com/ds/4N/4N35-M.pdf; MF: FAIRCHILD SEMICONDUCTOR; MPN: 4N35S-M; OC_FARNELL: 1021179; OC_NEWARK: 67K2285
RN1-RN10 = resistor-net:RN08: RESISTOR NETWORK; OC_FARNELL: unknown; OC_NEWARK: unknown
SW-1-SW-80 = cherrymx:CHERRY-MX-LED: Cherry MX series keyswitch with LED